# EAGLE schematic zero_board (EAGLE 9.6.2)
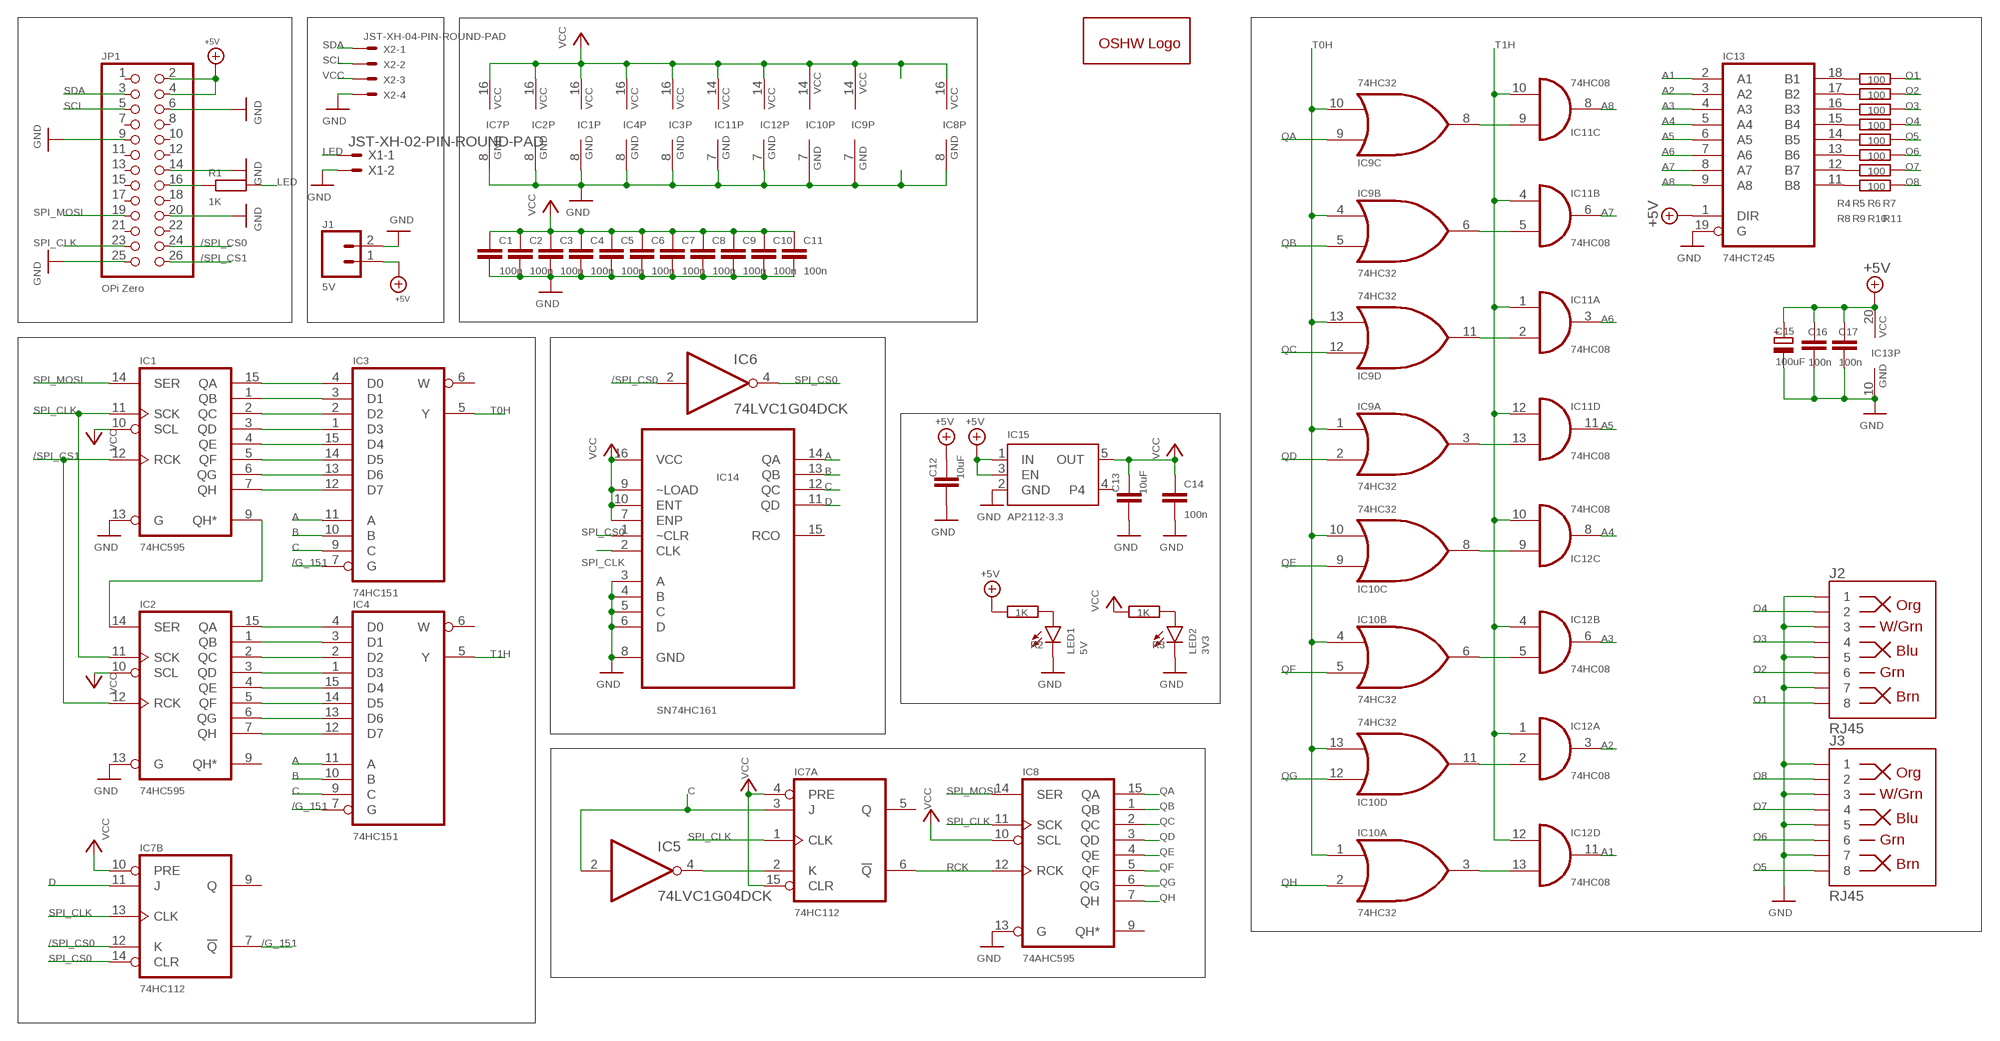
[diagram p0: schematic, sheet 1]

## Parts
C1  100n  C-EUC0603  [C0603]
C2  100n  C-EUC0603  [C0603]
C3  100n  C-EUC0603  [C0603]
C4  100n  C-EUC0603  [C0603]
C5  100n  C-EUC0603  [C0603]
C6  100n  C-EUC0603  [C0603]
C7  100n  C-EUC0603  [C0603]
C8  100n  C-EUC0603  [C0603]
C9  100n  C-EUC0603  [C0603]
C10  100n  C-EUC0603  [C0603]
C11  100n  C-EUC0603  [C0603]
C12  10uF  C-EUC0805  [C0805]
C13  10uF  C-EUC0805  [C0805]
C14  100n  C-EUC0603  [C0603]
C15  100uF  CPOL-EUE2.5-5  [E2,5-5]
C16  100n  C-EUC0603  [C0603]
C17  100n  C-EUC0603  [C0603]
GOLD_ORB_SM1  OSHWLOGOLOGO5MM  [OSHW_5MM]
IC1  74HC595  74HC595D  [SO16]
IC2  74HC595  74HC595D  [SO16]
IC3  74HC151  74HC151D  [SO16]
IC4  74HC151  74HC151D  [SO16]
IC5  74LVC1G04DCK  [SC70-5]
IC6  74LVC1G04DCK  [SC70-5]
IC7  74HC112  74HC112D  [SO16]
IC8  74AHC595  74HC595D  [SO16]
IC9  74HC32  74LS32D  [SO14]
IC10  74HC32  74LS32D  [SO14]
IC11  74HC08  74HC08D  [SO14]
IC12  74HC08  74HC08D  [SO14]
IC13  74HCT245  74ACT245DW  [SO20W]
IC14  SN74HC161  SN74HC161DR  [SOIC127P600X175-16N]
IC15  AP2112-3.3  VREG_SOT23-5  [SOT23-5]
J1  5V  CONN_023.5MM  [SCREWTERMINAL-3.5MM-2]
J2  RJ45  RJ45-8  [RJ45-8]
J3  RJ45  RJ45-8  [RJ45-8]
JP1  OPi Zero  PINHD-2X13  [2X13]
LED1  5V  LEDCHIP-LED0603  [CHIP-LED0603]
LED2  3V3  LEDCHIP-LED0603  [CHIP-LED0603]
R1  1K  R-EU_R0603  [R0603]
R2  1K  R-EU_R0603  [R0603]
R3  1K  R-EU_R0603  [R0603]
R4  100  R-EU_R0603  [R0603]
R5  100  R-EU_R0603  [R0603]
R6  100  R-EU_R0603  [R0603]
R7  100  R-EU_R0603  [R0603]
R8  100  R-EU_R0603  [R0603]
R9  100  R-EU_R0603  [R0603]
R10  100  R-EU_R0603  [R0603]
R11  100  R-EU_R0603  [R0603]
X1  JST-XH-02-PIN-ROUND-PAD  [JST-XH-02-PACKAGE-ROUND-PAD]
X2  JST-XH-04-PIN-ROUND-PAD  [JST-XH-04-PACKAGE-ROUND-PAD]

## Nets
+5V: C12.1 C15.+ C16.1 C17.1 IC13.1(DIR) IC13.20(VCC) IC15.1(IN) IC15.3(EN) J1.1 JP1.2 JP1.4 R2.1
/G_151: IC3.7(G) IC4.7(G) IC7.7(B:!Q)
/SPI_CS0: IC6.2(I) IC7.12(B:K) JP1.24
/SPI_CS1: IC1.12(RCK) IC2.12(RCK) JP1.26
A: IC3.11(A) IC4.11(A) IC14.14(QA)
A1: IC12.11(D:O) IC13.2(A1)
A2: IC12.3(A:O) IC13.3(A2)
A3: IC12.6(B:O) IC13.4(A3)
A4: IC12.8(C:O) IC13.5(A4)
A5: IC11.11(D:O) IC13.6(A5)
A6: IC11.3(A:O) IC13.7(A6)
A7: IC11.6(B:O) IC13.8(A7)
A8: IC11.8(C:O) IC13.9(A8)
B: IC3.10(B) IC4.10(B) IC14.13(QB)
C: IC3.9(C) IC4.9(C) IC5.2(I) IC7.3(A:J) IC14.12(QC)
D: IC7.11(B:J) IC14.11(QD)
GND: C1.2 C2.2 C3.2 C4.2 C5.2 C6.2 C7.2 C8.2 C9.2 C10.2 C11.2 C12.2 C13.2 C14.2 C15.- C16.2 C17.2 IC1.8(GND) IC1.13(G) IC2.8(GND) IC2.13(G) IC3.8(GND) IC4.8(GND) IC7.8(P:GND) IC8.8(GND) IC8.13(G) IC9.7(P:GND) IC10.7(P:GND) IC11.7(P:GND) IC12.7(P:GND) IC13.10(GND) IC13.19(G) IC14.3(A) IC14.4(B) IC14.5(C) IC14.6(D) IC14.8(GND) IC15.2(GND) J1.2 J2.1 J2.3 J2.5 J2.7 J3.1 J3.3 J3.5 J3.7 JP1.6 JP1.9 JP1.14 JP1.20 JP1.25 LED1.C LED2.C X1.2 X2.4
LED: R1.2 X1.1
N$1: IC10.11(D:O) IC12.2(A:I1)
N$2: IC10.6(B:O) IC12.5(B:I1)
N$3: IC10.8(C:O) IC12.9(C:I0)
N$4: IC10.3(A:O) IC12.13(D:I1)
N$5: IC9.8(C:O) IC11.9(C:I0)
N$6: IC9.6(B:O) IC11.5(B:I1)
N$7: IC9.11(D:O) IC11.2(A:I1)
N$8: JP1.16 R1.1
N$9: IC13.17(B2) R5.1
N$10: IC13.16(B3) R6.1
N$11: IC1.15(QA) IC3.4(D0)
N$12: IC1.1(QB) IC3.3(D1)
N$13: IC1.2(QC) IC3.2(D2)
N$14: IC1.3(QD) IC3.1(D3)
N$15: IC5.4(O) IC7.2(A:K)
N$16: IC9.3(A:O) IC11.13(D:I1)
N$17: IC13.15(B4) R7.1
N$18: IC13.18(B1) R4.1
N$19: IC2.15(QA) IC4.4(D0)
N$20: IC13.14(B5) R8.1
N$21: IC1.4(QE) IC3.15(D4)
N$22: IC1.5(QF) IC3.14(D5)
N$23: IC1.6(QG) IC3.13(D6)
N$24: IC1.7(QH) IC3.12(D7)
N$25: IC2.1(QB) IC4.3(D1)
N$26: IC13.13(B6) R9.1
N$27: IC2.2(QC) IC4.2(D2)
N$28: IC2.3(QD) IC4.1(D3)
N$29: IC2.4(QE) IC4.15(D4)
N$30: IC2.5(QF) IC4.14(D5)
N$31: IC2.6(QG) IC4.13(D6)
N$32: IC2.7(QH) IC4.12(D7)
N$33: IC13.12(B7) R10.1
N$34: IC13.11(B8) R11.1
N$35: LED1.A R2.2
N$36: LED2.A R3.2
N$44: IC1.9(QH*) IC2.14(SER)
O1: J2.8 R4.2
O2: J2.6 R5.2
O3: J2.4 R6.2
O4: J2.2 R7.2
O5: J3.8 R8.2
O6: J3.6 R9.2
O7: J3.4 R10.2
O8: J3.2 R11.2
QA: IC8.15(QA) IC9.9(C:I0)
QB: IC8.1(QB) IC9.5(B:I1)
QC: IC8.2(QC) IC9.12(D:I0)
QD: IC8.3(QD) IC9.2(A:I1)
QE: IC8.4(QE) IC10.9(C:I0)
QF: IC8.5(QF) IC10.5(B:I1)
QG: IC8.6(QG) IC10.12(D:I0)
QH: IC8.7(QH) IC10.2(A:I1)
RCK: IC7.6(A:!Q) IC8.12(RCK)
SCL: JP1.5 X2.2
SDA: JP1.3 X2.1
SPI_CLK: IC1.11(SCK) IC2.11(SCK) IC7.1(A:CLK) IC7.13(B:CLK) IC8.11(SCK) IC14.2(CLK) JP1.23
SPI_CS0: IC6.4(O) IC7.14(B:CLR) IC14.1(~CLR)
SPI_MOSI: IC1.14(SER) IC8.14(SER) JP1.19
T0H: IC3.5(Y) IC9.1(A:I0) IC9.4(B:I0) IC9.10(C:I1) IC9.13(D:I1) IC10.1(A:I0) IC10.4(B:I0) IC10.10(C:I1) IC10.13(D:I1)
T1H: IC4.5(Y) IC11.1(A:I0) IC11.4(B:I0) IC11.10(C:I1) IC11.12(D:I0) IC12.1(A:I0) IC12.4(B:I0) IC12.10(C:I1) IC12.12(D:I0)
VCC: C1.1 C2.1 C3.1 C4.1 C5.1 C6.1 C7.1 C8.1 C9.1 C10.1 C11.1 C13.1 C14.1 IC1.10(SCL) IC1.16(VCC) IC2.10(SCL) IC2.16(VCC) IC3.16(VCC) IC4.16(VCC) IC7.4(A:PRE) IC7.10(B:PRE) IC7.15(A:CLR) IC7.16(P:VCC) IC8.10(SCL) IC8.16(VCC) IC9.14(P:VCC) IC10.14(P:VCC) IC11.14(P:VCC) IC12.14(P:VCC) IC14.7(ENP) IC14.9(~LOAD) IC14.10(ENT) IC14.16(VCC) IC15.5(OUT) R3.1 X2.3
Unconnected: IC2.9(QH*) IC3.6(W) IC4.6(W) IC7.5(A:Q) IC7.9(B:Q) IC8.9(QH*) IC14.15(RCO) IC15.4 JP1.1 JP1.7 JP1.8 JP1.10 JP1.11 JP1.12 JP1.13 JP1.15 JP1.17 JP1.18 JP1.21 JP1.22

## Power pins joined to a net without a drawn wire
GND: IC5.3(GND) IC6.3(GND)
VCC: IC5.5(VCC) IC6.5(VCC)

## Library data of the parts
C1-C14 C16 C17 = rcl:C-EU: CAPACITOR, European symbol; SPICEPREFIX: C
C15 = rcl:CPOL-EU: POLARIZED CAPACITOR, European symbol; SPICEPREFIX: C
GOLD_ORB_SM1 = oshw:OSHWLOGO: The OSHW logo for PCB layout
IC1 IC2 IC8 = 74xx-eu:74*595: 8-bit SHIFT REGISTER, output latch
IC3 IC4 = 74xx-eu:74*151: Data SELECTOR/MULTIPLEXER
IC5 IC6 = 74xx-little-us:74*1G04: INVERTER Gate
IC7 = 74xx-eu:74*112: Dual J-K negative edge triggered FLIP FLOP, preset and clear
IC9 IC10 = 74xx-us:74*32: Quad 2-input OR gate
IC11 IC12 = 74xx-eu:74*08: Quad 2-input AND gate
IC13 = 74xx-eu:74*245: Octal BUS TRANSCEIVER, 3-state
IC14 = SN74HC161DR:SN74HC161DR: 4-Bit Synchronus Binary Counters; AVAILABILITY: Unavailable; DESCRIPTION: 4-Bit Synchronous Binary Counters 16-SOIC -40 to 85; MF: Texas Instruments; MP: SN74HC161DR; PACKAGE: SOIC-16 Texas Instruments; PRICE: None
IC15 = microbuilder:VREG_SOT23-5: SOT23-5 Fixed Voltage Regulators Part Current Out V Out V In V Dropout θJA (°C/W) TJ (°C) Digikey Part No. ADP121 150mA 3.3V 3.4-5.5V 0.09V @ 150mA -- -- ADP121-AUJZ33R7CT-ND ADP121 150mA 3.0V 3.1-5.5V 0.09V @ 150mA -- -- ADP121-AUJZ30R7CT-ND ADP122 300mA 3.3V 3.4-5.5V 0.085V @ 300mA -- -- ADP122AUJZ-3.3-R7CT-ND ADP1712 300mA 3.3V 3.5-5.5V 0.17V @ 300mA -- -- ADP1712AUJZ-3.3-R7TR-ND AP7311 (Low Cost) 150mA 3.3V 3.5-6V 0.15V @ 150mA -- -- AP7311-33WG-7DICT-ND LD39015M18R 150mA 1.8V 1.9V-5.5V 0.08V @ 100mA -- -- 497-6977-1-ND LP2985A-33DBVR 150mA 3.3V 3.3-16V 0.28V @ 150mA 206 150 296-18479-1-ND MCP1824T-3302E/OT 300mA 3.3V 3.5V-6V 0.2V @ 300mA -- -- MCP1824T-3302E/OTCT-ND MIC5205-2.5YM5 TR 150mA 2.5V 2.7-16V 0.165V @ 150mA -- -- 576-1257-2-ND MIC5205-3.0YM5 TR 150mA 3.0V 3.2V-16V 0.165V @ 150mA -- -- 576-1258-2-ND MIC5205-3.3YM5 TR 150mA 3.3V 3.5V-16V 0.165V @ 150mA -- -- 576-1259-2-ND TPS780330220 150mA 3.3V+2.2V 3.6-5.5V 250mV Max -- -- 296-23332-1-ND TDA3663/N1,135 100mA 3.3V 3.5-45V 0.18V @ 50mA -- -- 568-5343-1-ND Max operating temp can be calculated using θJA, TJ (max junction temperature), and power in watts. Set the "Maximum Ambient Temperature" until it reaches TJ ("Max Junction Temperature"), which is the absolute limit for safe use of the regulator: Heat Sink Temperature Calculator <http://www.daycounter.com/Calculators/Heat-Sink-Temperature-Calculator.phtml> For example, With 12V source into a 3.3V LP2985 and a 30mA load, we are dissipating (12V-3.3V) * 0.03A = 0.261W. With a θJA of 206 °C/W, a TJ of 150°C, and 261mW we can safely use the chip without a heat sink up to 75°C (=147.1°C Junction Temperature).
J1 = SparkFun-Connectors:CONN_02: Multi connection point. Often used as Generic Header-pin footprint for 0.1 inch spaced/style header connections On any of the 0.1 inch spaced packages, you can populate with these: Break Away Headers - Straight <https://www.sparkfun.com/products/116> (PRT-00116) Break Away Male Headers - Right Angle <https://www.sparkfun.com/products/553> (PRT-00553) Female Headers <https://www.sparkfun.com/products/115> (PRT-00115) Break Away Headers - Machine Pin <https://www.sparkfun.com/products/117> (PRT-00117) Break Away Female Headers - Swiss Machine Pin <https://www.sparkfun.com/products/743> (PRT-00743) For SCREWTERMINALS and SPRING TERMINALS visit here: Screw Terimnals on SparkFun.com <https://www.sparkfun.com/search/results?term=Screw+Terminals> (5mm/3.5mm/2.54mm spacing) This device is also useful as a general connection point to wire up your design to another part of your project. Our various solder wires solder well into these plated through hole pads. Hook-Up Wire - Assortment (Stranded, 22 AWG) <https://www.sparkfun.com/products/11375> (PRT-11375) Hook-Up Wire - Assortment (Solid Core, 22 AWG) <https://www.sparkfun.com/products/11367> (PRT-11367) View the entire wire category on our website here <https://www.sparkfun.com/categories/141> Special notes: Molex polarized connector foot print use with: PRT-08233 with associated crimp pins and housings. 2.54_SCREWTERM for use with PRT-10571. 3.5mm Screw Terminal footprints for PRT-08084 5mm Screw Terminal footprints for use with PRT-08432; PROD_ID: CONN-08399
J2 J3 = SparkFun-Connectors:RJ45-8: RJ45 Jack - 8 pin Simple RJ45, 8-pin connection. Commonly used for Cat5, Cat5e, and Cat6 Ethernet cables. Here is the connector we sell at SparkFun: RJ45 8-Pin Connector <https://www.sparkfun.com/products/643> (PRT-00643) Datasheet <https://cdn.sparkfun.com/datasheets/Prototyping/04908.pdf> It is used on this SparkFun product: SparkFun RJ45 Breakout <https://www.sparkfun.com/products/716> (BOB-00716) Note, you may also be interested in the "MAGJACK" version of this. It is basically a RJ45 connector, but also has some status LEDs built into the connector housing. You can check that out in this library at the device named "MAGJACK.dev" and see these products online: RJ45 Ethernet MagJack-Compatible <https://www.sparkfun.com/products/8534> (PRT-08534) SparkFun RJ45 MagJack Breakout <https://www.sparkfun.com/products/13021> (BOB-13021); PROD_ID: CONN-08506; SF_ID: PRT-00643
JP1 = pinhead:PINHD-2X13: PIN HEADER
LED1 LED2 = led:LED: LED OSRAM: - CHIPLED LG R971, LG N971, LY N971, LG Q971, LY Q971, LO R971, LY R971 LH N974, LH R974 LS Q976, LO Q976, LY Q976 LO Q996 - Hyper CHIPLED LW Q18S LB Q993, LB Q99A, LB R99A - SideLED LS A670, LO A670, LY A670, LG A670, LP A670 LB A673, LV A673, LT A673, LW A673 LH A674 LY A675 LS A676, LA A676, LO A676, LY A676, LW A676 LS A679, LY A679, LG A679 - Hyper Micro SIDELED® LS Y876, LA Y876, LO Y876, LY Y876 LT Y87S - SmartLED LW L88C, LW L88S LB L89C, LB L89S, LG L890 LS L89K, LO L89K, LY L89K LS L896, LA L896, LO L896, LY L896 - TOPLED LS T670, LO T670, LY T670, LG T670, LP T670 LSG T670, LSP T670, LSY T670, LOP T670, LYG T670 LG T671, LOG T671, LSG T671 LB T673, LV T673, LT T673, LW T673 LH T674 LS T676, LA T676, LO T676, LY T676, LB T676, LH T676, LSB T676, LW T676 LB T67C, LV T67C, LT T67C, LS T67K, LO T67K, LY T67K, LW E67C LS E67B, LA E67B, LO E67B, LY E67B, LB E67C, LV E67C, LT E67C LW T67C LS T679, LY T679, LG T679 LS T770, LO T770, LY T770, LG T770, LP T770 LB T773, LV T773, LT T773, LW T773 LH T774 LS E675, LA E675, LY E675, LS T675 LS T776, LA T776, LO T776, LY T776, LB T776 LHGB T686 LT T68C, LB T68C - Hyper Mini TOPLED® LB M676 - Mini TOPLED Santana® LG M470 LS M47K, LO M47K, LY M47K Source: http://www.osram.convergy.de LUXEON: - LUMILED® LXK2-PW12-R00, LXK2-PW12-S00, LXK2-PW14-U00, LXK2-PW14-V00 LXK2-PM12-R00, LXK2-PM12-S00, LXK2-PM14-U00 LXK2-PE12-Q00, LXK2-PE12-R00, LXK2-PE12-S00, LXK2-PE14-T00, LXK2-PE14-U00 LXK2-PB12-K00, LXK2-PB12-L00, LXK2-PB12-M00, LXK2-PB14-N00, LXK2-PB14-P00, LXK2-PB14-Q00 LXK2-PR12-L00, LXK2-PR12-M00, LXK2-PR14-Q00, LXK2-PR14-R00 LXK2-PD12-Q00, LXK2-PD12-R00, LXK2-PD12-S00 LXK2-PH12-R00, LXK2-PH12-S00 LXK2-PL12-P00, LXK2-PL12-Q00, LXK2-PL12-R00 Source: www.luxeon.com KINGBRIGHT: KA-3528ASYC Source: www.kingbright.com
R1-R11 = rcl:R-EU_: RESISTOR, European symbol
X1 = Rembrandt Electronics - JST XH Connectors v1-0:JST-XH-02-PIN: JST XH Connector 2 Pin Wire to board connector. Pitch: 2,54 mm, (0.100") Number of pins: 2 Created by Rembrandt Electronics www.rembrandtelectronics.com
X2 = Rembrandt Electronics - JST XH Connectors v1-0:JST-XH-04-PIN: JST XH Connector 2 Pin Wire to board connector. Pitch: 2,54 mm, (0.100") Number of pins: 4 Created by Rembrandt Electronics www.rembrandtelectronics.com

## Net classes
0 default: clearance 0.205 mm